# EAGLE schematic Advanced_Breakout_Shield (EAGLE 7.2.0)
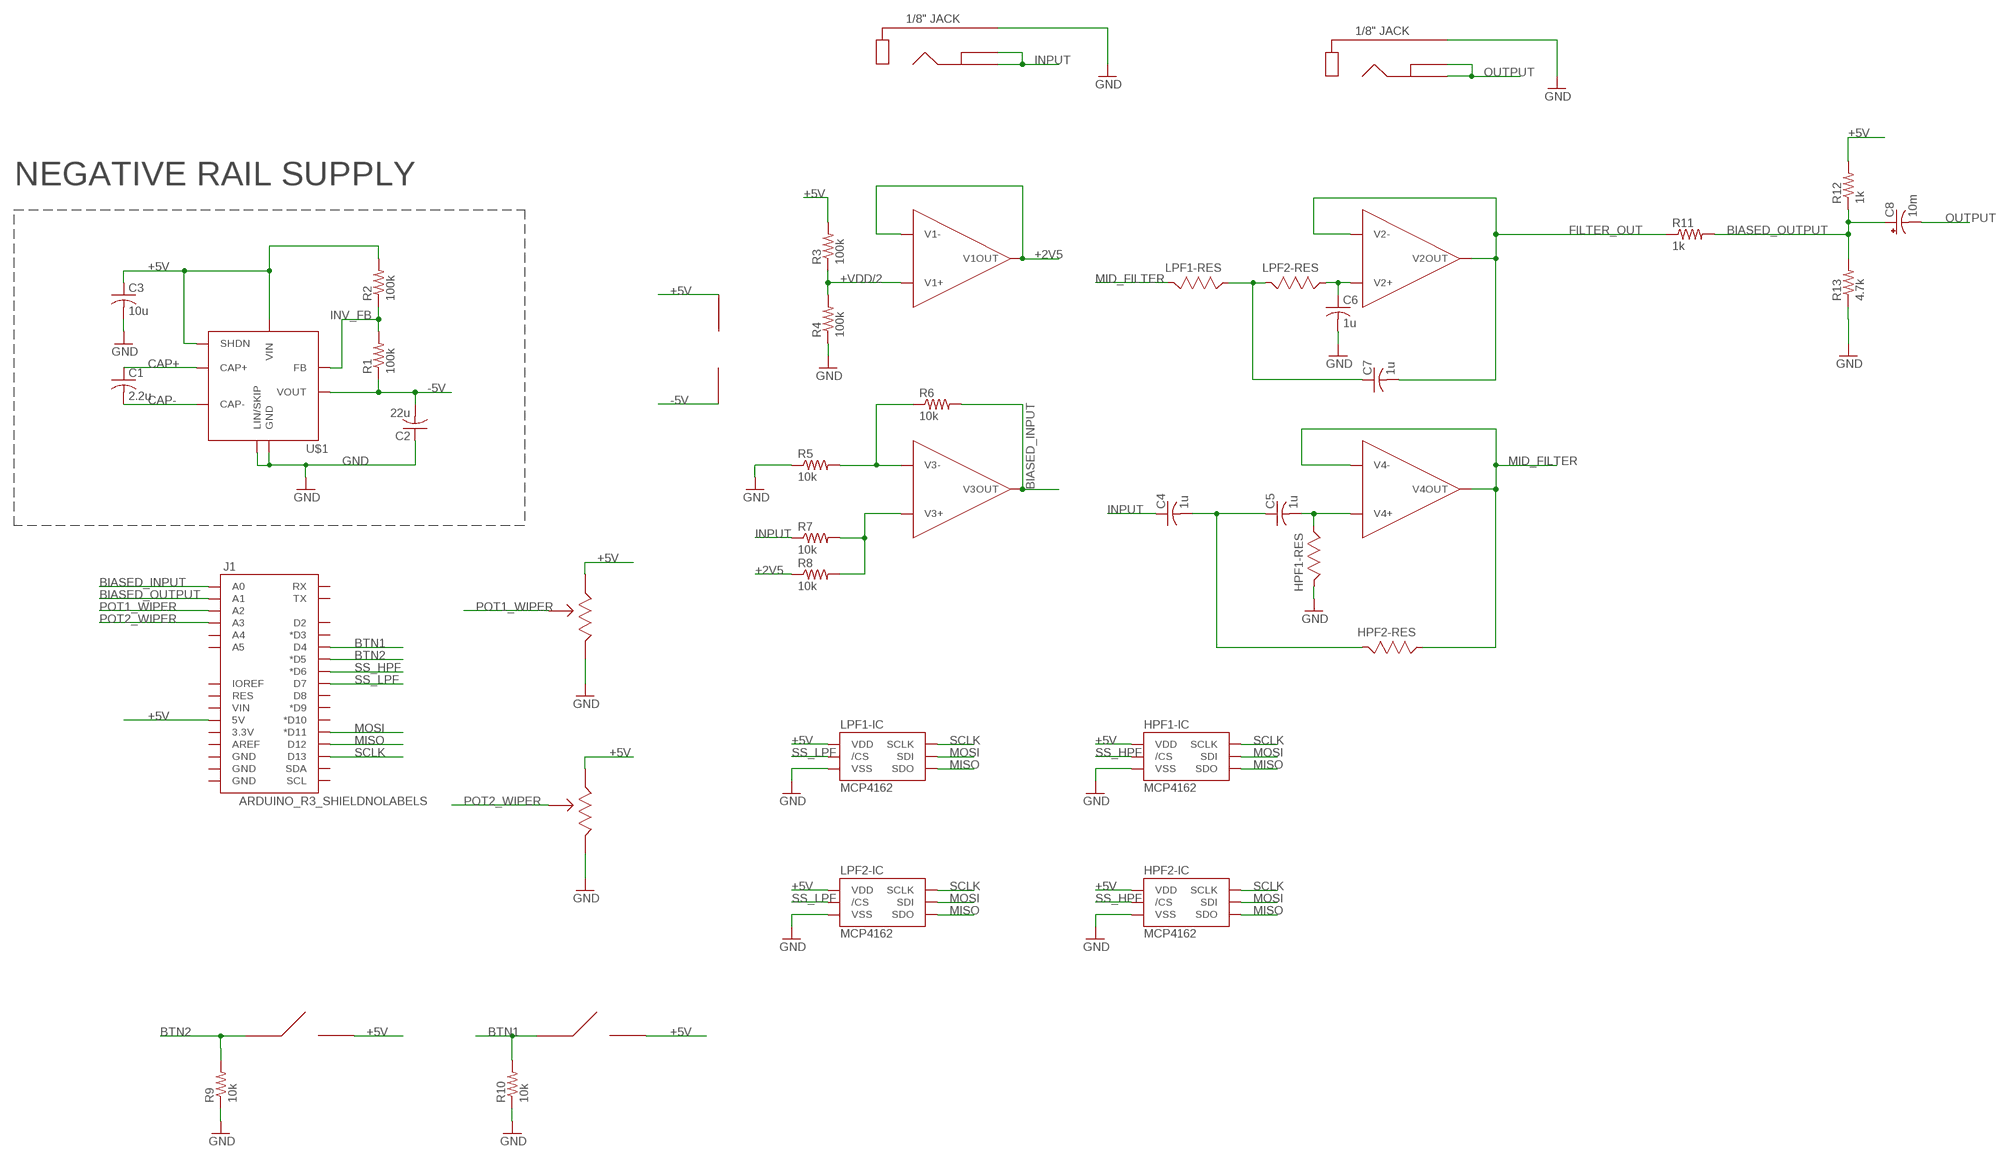
[diagram p0: schematic, sheet 1]

## Parts
C1  2.2u  C-USC1206K  [C1206K]
C2  22u  C-USC1206K  [C1206K]
C3  10u  C-USC1206K  [C1206K]
C4  1u  C-USC1206K  [C1206K]
C5  1u  C-USC1206K  [C1206K]
C6  1u  C-USC1206K  [C1206K]
C7  1u  C-USC1206K  [C1206K]
C8  10m  CPOL-USE7.5-16  [E7,5-16]
HPF1  MCP4162-502E  [DIL08]
HPF2  MCP4162-502E  [DIL08]
J1  ARDUINO_R3_SHIELDNOLABELS  [UNO_R3_SHIELD_NOLABELS]
LPF1  MCP4162-502E  [DIL08]
LPF2  MCP4162-502E  [DIL08]
R1  100k  R-US_R1210  [R1210]
R2  100k  R-US_R1210  [R1210]
R3  100k  R-US_R1210  [R1210]
R4  100k  R-US_R1210  [R1210]
R5  10k  R-US_R1210  [R1210]
R6  10k  R-US_R1210  [R1210]
R7  10k  R-US_R1210  [R1210]
R8  10k  R-US_R1210  [R1210]
R9  10k  R-US_R1210  [R1210]
R10  10k  R-US_R1210  [R1210]
R11  1k  R-US_R1210  [R1210]
R12  1k  R-US_R1210  [R1210]
R13  4.7k  R-US_R1210  [R1210]
U$1  MAX1673  MAX1673ESA  [SO08]
U$2  TLV974  [DIL14]
U$3  P120PK  [P120PK]
U$4  P120PK  [P120PK]
U$5  AUDIO_JACK  [AUDIO_JACK]
U$6  AUDIO_JACK  [AUDIO_JACK]
U$7  IEEE_LOGO_BUTTON  [IEEE_LOGO_BUTTON]
U$8  IEEE_LOGO_BUTTON  [IEEE_LOGO_BUTTON]

## Nets
+2V5: R8.1 U$2.1(V1OUT) U$2.2(V1-)
+5V: C3.1 HPF1.8(-IC:VDD) HPF2.8(-IC:VDD) J1.5V LPF1.8(-IC:VDD) LPF2.8(-IC:VDD) R2.2 R3.2 R12.2 U$1.4(SHDN) U$1.8(VIN) U$2.4(+VCC) U$3.PR(RA) U$4.PR(RA) U$7.P$2 U$8.P$2
+VDD/2: R3.1 R4.2 U$2.3(V1+)
-5V: C2.2 R1.1 U$1.5(VOUT) U$2.11(-VCC)
BIASED_INPUT: J1.A0 R6.2 U$2.8(V3OUT)
BIASED_OUTPUT: C8.+ J1.A1 R11.2 R12.1 R13.2
BTN1: J1.D4 R10.2 U$8.P$1
BTN2: J1.D5(*D5) R9.2 U$7.P$1
CAP+: C1.1 U$1.2(CAP+)
CAP-: C1.2 U$1.3(CAP-)
FILTER_OUT: C7.2 R11.1 U$2.6(V2-) U$2.7(V2OUT)
GND: C2.1 C3.2 C6.2 HPF1.4(-IC:VSS) HPF1.6(-RES:BASE) HPF2.4(-IC:VSS) LPF1.4(-IC:VSS) LPF2.4(-IC:VSS) R4.1 R5.1 R9.1 R10.1 R13.1 U$1.1(LIN/SKIP) U$1.7(GND) U$3.PM(RB) U$4.PM(RB) U$5.SLEEVE U$6.SLEEVE
INPUT: C4.1 R7.1 U$5.RING U$5.TIP
INV_FB: R1.2 R2.1 U$1.6(FB)
MID_FILTER: HPF2.5(-RES:WIPER) LPF1.6(-RES:BASE) U$2.13(V4-) U$2.14(V4OUT)
MISO: HPF1.7(-IC:SDO) HPF2.7(-IC:SDO) J1.D12 LPF1.7(-IC:SDO) LPF2.7(-IC:SDO)
MOSI: HPF1.3(-IC:SDI) HPF2.3(-IC:SDI) J1.D11(*D11) LPF1.3(-IC:SDI) LPF2.3(-IC:SDI)
N$1: R5.2 R6.1 U$2.9(V3-)
N$2: C5.2 HPF1.5(-RES:WIPER) U$2.12(V4+)
N$3: R7.2 R8.2 U$2.10(V3+)
N$4: C4.2 C5.1 HPF2.6(-RES:BASE)
N$7: C6.1 LPF2.5(-RES:WIPER) U$2.5(V2+)
N$9: C7.1 LPF1.5(-RES:WIPER) LPF2.6(-RES:BASE)
OUTPUT: C8.- U$6.RING U$6.TIP
POT1_WIPER: J1.A2 U$3.PL(RW)
POT2_WIPER: J1.A3 U$4.PL(RW)
SCLK: HPF1.2(-IC:SCLK) HPF2.2(-IC:SCLK) J1.D13 LPF1.2(-IC:SCLK) LPF2.2(-IC:SCLK)
SS_HPF: HPF1.1(-IC:/CS) HPF2.1(-IC:/CS) J1.D6(*D6)
SS_LPF: J1.D7 LPF1.1(-IC:/CS) LPF2.1(-IC:/CS)
Unconnected: J1.3.3V J1.A4 J1.A5 J1.AREF J1.D2 J1.D3(*D3) J1.D8 J1.D9(*D9) J1.D10(*D10) J1.GND@0(GND) J1.GND@1(GND) J1.GND@2(GND) J1.IOREF J1.RES J1.RX J1.SCL J1.SDA J1.TX J1.VIN

## Notes on the sheet
- NEGATIVE RAIL SUPPLY

## Library data of the parts
C1-C7 = rcl:C-US: CAPACITOR, American symbol
C8 = rcl:CPOL-US: POLARIZED CAPACITOR, American symbol
HPF1 HPF2 LPF1 LPF2 = Workshop_Library:MCP4162-502E: MCP4162-502E/P Digital Potentiomer
J1 = Workshop_Library:ARDUINO_R3_SHIELD: Shield form compatible with the Arduino Uno R3.
R1-R13 = rcl:R-US_: RESISTOR, American symbol
U$1 = Workshop_Library:MAX1673ESA
U$2 = Workshop_Library:TLV974
U$3 U$4 = Workshop_Library:P120PK
U$5 U$6 = Workshop_Library:AUDIO_JACK
U$7 U$8 = Workshop_Library:IEEE_LOGO_BUTTON